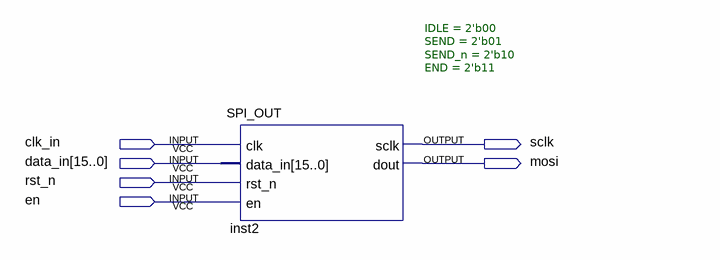
[diagram p0: schematic sheet]
// Quartus schematic FPGA_EP2C.bdf as structural Verilog: 1 symbols, 6 pins
module FPGA_EP2C (
  input  clk_in,
  input  [15:0] data_in,
  input  rst_n,
  input  en,
  output sclk,
  output mosi
);

  SPI_OUT #(.IDLE(2'b00), .SEND(2'b01), .SEND_n(2'b10), .END(2'b11)) inst2 (
    .clk(clk_in), .data_in(data_in), .rst_n(rst_n), .en(en), .sclk(sclk), .dout(mosi));
endmodule
